# Altium schematic sheet FogCalBoard.SchDoc: Sample Sheet Title
size B; Date: MM/DD/YYYY; Author: Sample Author; Organization: ORGANIZATION; Address1: ADDRESS 1; Address2: ADDRESS 2; Address3: ADDRESS 3; Address4: ADDRESS 4; Revision: -; SheetNumber: 1; SheetTotal: 2; ENG_APP_DATE: --/--/--; DSN_APP_DATE: --/--/--; CHK_APP_DATE: --/--/--
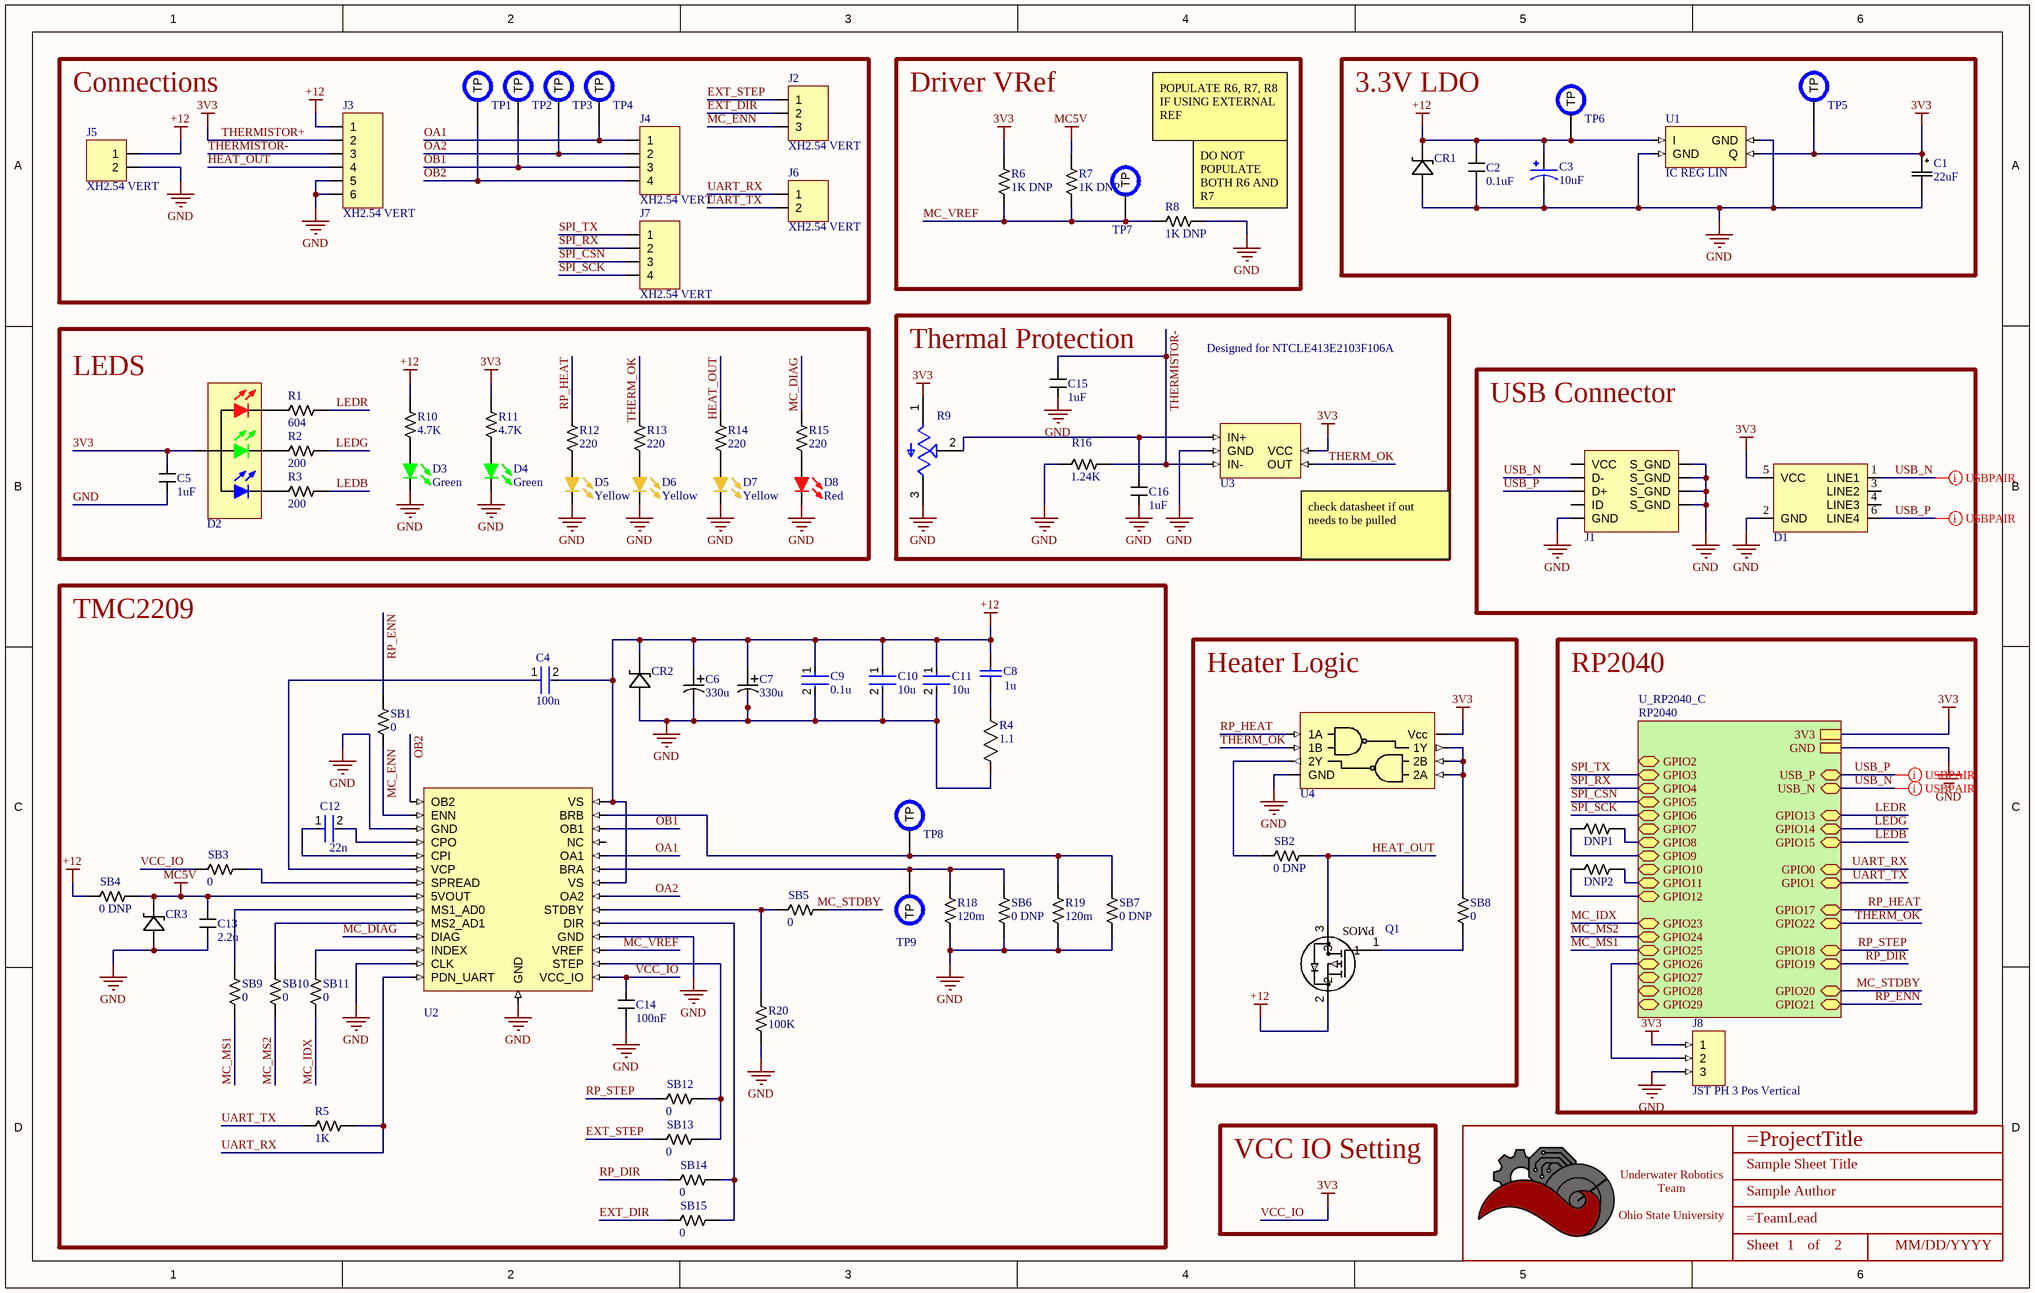
[diagram p0: FogCalBoard.SchDoc]

## Parts
*  Title_Block  [LOGO]  (value not drawn)  (graphical)
C1  value 22uF  [PCAP_8x5.4-ELECT_NCA]  (hidden comment: 22uF electrolytic 35 V)
C2  value 0.1uF  [CAPACITOR_0603]  (hidden comment: 100nF Ceramic 25V)
C3  value 10uF  [CAP_EEHZC1J100P]  (hidden comment: 10uF electrolytic 63V)
C4  100n  [FP-CC0603-DA-IPC_A]
C5  value 1uF  [CAPACITOR_0402]  (hidden comment: 1uF Ceramic 16V)
C6  value 330u  [CAP_EEE-FT1H331AP]  (hidden comment: EEE-FT1H331AP)
C7  value 330u  [CAP_EEE-FT1H331AP]  (hidden comment: EEE-FT1H331AP)
C8  1u  [CAPC1210(3225)220_N]
C9  0.1u  [FP-CC0603-DA-MFG]
C10  10u  [FP-2220-L_5_7_0_5-W_5_0_4-IPC_A]
C11  10u  [FP-2220-L_5_7_0_5-W_5_0_4-IPC_A]
C12  22n  [FP-C0805C-DN-MFG]
C13  value 2.2u  [CAPACITOR_0603]  (hidden comment: GRT188R61H225KE13D)
C14  Capacitance: 100nF  [CAPACITOR_0603]  (hidden comment: CC0603KRX7R9B1B10)
C15  value 1uF  [CAPACITOR_0603]  (hidden comment: 1uF Ceramic 16V)
C16  value 1uF  [CAPACITOR_0603]  (hidden comment: 1uF Ceramic 16V)
CR1  SMAJP4KE18A-TP  [DO-214AC]  (value not drawn)
CR2  SMAJP4KE18A-TP  [DO-214AC]  (value not drawn)
CR3  SMBJ5.0A  [DO-214AA]  (value not drawn)
D1  TVS DIODE 5VWM 25VC SOT23-6  [SOT 23-6L]  (value not drawn)
D2  EAST1616RGBB4  [LED_0606_4SMD]  (value not drawn)
D3  Color: Green  [LED_0603]  (hidden comment: IN-S63AT5G)
D4  Color: Green  [LED_0603]  (hidden comment: IN-S63AT5G)
D5  Color: Yellow  [LED_0603]  (hidden comment: 150060YS75000)
D6  Color: Yellow  [LED_0603]  (hidden comment: 150060YS75000)
D7  Color: Yellow  [LED_0603]  (hidden comment: 150060YS75000)
D8  Color: Red  [LED_0603]  (hidden comment: 150060RS75000)
DNP1  DNP  [RESISTOR_0402]  (value not drawn)
DNP2  DNP  [RESISTOR_0402]  (value not drawn)
J1  USB_MICRO R/A  [CONN_MINIUSB]  (value not drawn)
J2  XH2.54 VERT  [CONN_JST_XH254_3POS_VERT]
J3  XH2.54 VERT  [CONN_JST_XH254_6POS_VERT]
J4  XH2.54 VERT  [CONN_JST_XH254_4POS_VERT]
J5  XH2.54 VERT  [CONN_JST_XH254_2POS_VERT]
J6  XH2.54 VERT  [CONN_JST_XH254_2POS_VERT]
J7  XH2.54 VERT  [CONN_JST_XH254_4POS_VERT]
J8  JST PH 3 Pos Vertical  [CONN_JST_PH_3POS_VERT]
Q1  MOSFET P-CHANNEL 20V 4.7A SOT23  [SOT-23-3]  (value not drawn)
R1  Value  (Ohms): 604  [RESISTOR_0402]  (hidden comment: 604 Ohm 1% 1/16W)
R2  Value  (Ohms): 200  [RESISTOR_0402]  (hidden comment: 200 Ohm 1% 1/16W)
R3  Value  (Ohms): 200  [RESISTOR_0402]  (hidden comment: 200 Ohm 1% 1/16W)
R4  value 1.1  [RESISTOR_0603]  (hidden comment: CRCW06031R10FKEA)
R5  value 1K  [RESISTOR_0603]  (hidden comment: RMCF0603FT1K00)
R6  Value  (Ohms): 1K DNP  [RESISTOR_0603]  (hidden comment: 1k Ohm 5% 1/8W)
R7  Value  (Ohms): 1K DNP  [RESISTOR_0603]  (hidden comment: 1k Ohm 5% 1/8W)
R8  Value  (Ohms): 1K DNP  [RESISTOR_0603]  (hidden comment: 1k Ohm 5% 1/8W)
R9  TC33X-2-203E  [TRIM_TC33X-2-203E]  (value not drawn)
R10  Value  (Ohms): 4.7K  [RESISTOR_0603]  (hidden comment: 4.7k Ohm 5% 1/10W)
R11  Value  (Ohms): 4.7K  [RESISTOR_0603]  (hidden comment: 4.7k Ohm 5% 1/10W)
R12  Value  (Ohms): 220  [RESISTOR_0603]  (hidden comment: 220 Ohm 5% 1/8W)
R13  Value  (Ohms): 220  [RESISTOR_0603]  (hidden comment: 220 Ohm 5% 1/8W)
R14  Value  (Ohms): 220  [RESISTOR_0603]  (hidden comment: 220 Ohm 5% 1/8W)
R15  Value  (Ohms): 220  [RESISTOR_0603]  (hidden comment: 220 Ohm 5% 1/8W)
R16  Value (Ohms): 1.24K  [RESISTOR_0603]  (hidden comment: RES 1.24K OHM 1% 1/10W 0603)
R18  value 120m  [RESISTOR_1210]  (hidden comment: RCWE1210R120FKEA)
R19  value 120m  [RESISTOR_1210]  (hidden comment: RCWE1210R120FKEA)
R20  Value  (Ohms): 100K  [RESISTOR_0603]  (hidden comment: 100k Ohm 5% 1/8W)
SB1  Value  (Ohms): 0  [RESISTOR_0603]  (hidden comment: 0 Ohm Jumper No Fit)
SB2  Value  (Ohms): 0 DNP  [RESISTOR_0603]  (hidden comment: 0 Ohm Jumper No Fit)
SB3  Value  (Ohms): 0  [RESISTOR_0603]  (hidden comment: 0 Ohm Jumper No Fit)
SB4  Value  (Ohms): 0 DNP  [RESISTOR_0603]  (hidden comment: 0 Ohm Jumper No Fit)
SB5  Value  (Ohms): 0  [RESISTOR_0603]  (hidden comment: 0 Ohm Jumper No Fit)
SB6  Value  (Ohms): 0 DNP  [RESISTOR_0603]  (hidden comment: 0 Ohm Jumper No Fit)
SB7  Value  (Ohms): 0 DNP  [RESISTOR_0603]  (hidden comment: 0 Ohm Jumper No Fit)
SB8  Value  (Ohms): 0  [RESISTOR_0603]  (hidden comment: 0 Ohm Jumper No Fit)
SB9  Value  (Ohms): 0  [RESISTOR_0603]  (hidden comment: 0 Ohm Jumper No Fit)
SB10  Value  (Ohms): 0  [RESISTOR_0603]  (hidden comment: 0 Ohm Jumper No Fit)
SB11  Value  (Ohms): 0  [RESISTOR_0603]  (hidden comment: 0 Ohm Jumper No Fit)
SB12  Value  (Ohms): 0  [RESISTOR_0603]  (hidden comment: 0 Ohm Jumper No Fit)
SB13  Value  (Ohms): 0  [RESISTOR_0603]  (hidden comment: 0 Ohm Jumper No Fit)
SB14  Value  (Ohms): 0  [RESISTOR_0603]  (hidden comment: 0 Ohm Jumper No Fit)
SB15  Value  (Ohms): 0  [RESISTOR_0603]  (hidden comment: 0 Ohm Jumper No Fit)
TP1  PCB Test Point  [TESTPOINT_1.2MM]  (value not drawn)  (no BOM)
TP2  PCB Test Point  [TESTPOINT_1.2MM]  (value not drawn)  (no BOM)
TP3  PCB Test Point  [TESTPOINT_1.2MM]  (value not drawn)  (no BOM)
TP4  PCB Test Point  [TESTPOINT_1.2MM]  (value not drawn)  (no BOM)
TP5  PCB Test Point  [TESTPOINT_1.2MM]  (value not drawn)  (no BOM)
TP6  PCB Test Point  [TESTPOINT_1.2MM]  (value not drawn)  (no BOM)
TP7  PCB Test Point  [TESTPOINT_1.2MM]  (value not drawn)  (no BOM)
TP8  PCB Test Point  [TESTPOINT_1.2MM]  (value not drawn)  (no BOM)
TP9  PCB Test Point  [TESTPOINT_1.2MM]  (value not drawn)  (no BOM)
U1  IC REG LIN  [SOT-223-4]
U2  TMC2209-LA-T  [QFN-28]  (value not drawn)
U3  IC COMPARATOR 1 GEN PUR SC70-5  [SOT-353]  (value not drawn)
U4  IC GATE NAND SCHMITT 2CH 2IN SM8  [MSOP-8_PI4ULS5V202UEX]  (value not drawn)

## Blocks framed on the sheet
Connections: J2-J7 TP1-TP4
Driver VRef: R6-R8 TP7
3.3V LDO: C1-C3 CR1 TP5 TP6 U1
LEDS: C5 D2-D8 R1-R3 R10-R15
Thermal Protection: C15 C16 R9 R16 U3
USB Connector: D1 J1
TMC2209: C4 C6-C14 CR2 CR3 R4 R5 R18-R20 SB1 SB3-SB7 SB9-SB15 TP8 TP9 U2
Heater Logic: Q1 SB2 SB8 U4
RP2040: DNP1 DNP2 J8

## Sub-sheets
U_RP2040_C = RP2040: GPIO0 (bidir), GPIO1 (bidir), GPIO2 (bidir), GPIO3 (bidir), GPIO4 (bidir), GPIO5 (bidir), GPIO6 (bidir), GPIO7 (bidir), GPIO8 (bidir), GPIO9 (bidir), GPIO10 (bidir), GPIO11 (bidir), GPIO12 (bidir), GPIO13 (bidir), GPIO14 (bidir), GPIO15 (bidir), GPIO17 (bidir), GPIO18 (bidir), GPIO19 (bidir), GPIO20 (bidir), GPIO21 (bidir), GPIO22 (bidir), GPIO23 (bidir), GPIO24 (bidir), GPIO25 (bidir), GPIO26 (bidir), GPIO27 (bidir), GPIO28 (bidir), GPIO29 (bidir), 3V3, GND, USB_P (bidir), USB_N (bidir)

## Nets
3V3: C1.1 C5.1 C14.1 D1.5(VCC) D2.4 J3.2 J8.1 R6.1 R9.1(CCW) R11.1 SB3.2 TP5.TP U1.3(Q) U2.15(VCC_IO) U3.5(VCC) U4.8(Vcc) ; sheet U_RP2040_C/3V3  [also labelled THERMISTOR+, VCC_IO]
+12: C2.2 C3.1 C4.2 C6.1 C7.1 C8.2 C9.1 C10.1 C11.1 CR1.1(ANODE) CR2.1(ANODE) J3.1 J5.1 Q1.2 R10.1 SB4.2 TP6.TP U1.1(I) U2.22(VS) U2.28(VS)
GND: C1.2 C2.1 C3.2 C5.2 C6.2 C7.2 C9.2 C10.2 C11.2 C13.2 C14.2 C15.2 C16.2 CR1.2(CATHODE) CR2.2(CATHODE) CR3.2(ANODE) D1.2(GND) D3.2 D4.2 D5.2 D6.2 D7.2 D8.2 J1.5(GND) J1.6(S_GND) J1.7(S_GND) J1.8(S_GND) J1.9(S_GND) J3.5 J3.6 J5.2 J8.3 R4.1 R8.1 R9.3(CW) R16.2 R18.2 R19.2 R20.2 SB6.2 SB7.2 U1.2(GND) U1.4(GND) U2.3(GND) U2.13(CLK) U2.18(GND) U2.29(GND) U3.2(GND) U4.4(GND) ; sheet U_RP2040_C/GND
MC5V: C13.1 CR3.1(CATHODE) R7.1 SB4.1 U2.8(5VOUT)
EXT_DIR: J2.2 SB15.2
EXT_STEP: J2.1 SB13.2
HEAT_OUT: J3.4 Q1.3 R14.1 SB2.1
LEDB: R3.1 ; sheet U_RP2040_C/GPIO15
LEDG: R2.1 ; sheet U_RP2040_C/GPIO14
LEDR: R1.1 ; sheet U_RP2040_C/GPIO13
MC_DIAG: R15.1 U2.11(DIAG)
MC_ENN: J2.3 SB1.2 U2.2(ENN)
MC_IDX: SB11.2 ; sheet U_RP2040_C/GPIO23
MC_MS1: SB9.2 ; sheet U_RP2040_C/GPIO25
MC_MS2: SB10.2 ; sheet U_RP2040_C/GPIO24
MC_STDBY: SB5.1 ; sheet U_RP2040_C/GPIO20
MC_VREF: R6.2 R7.2 R8.2 TP7.TP U2.17(VREF)
OA1: J4.1 TP4.TP U2.24(OA1)
OA2: J4.2 TP3.TP U2.21(OA2)
OB1: J4.3 TP2.TP U2.26(OB1)
OB2: J4.4 TP1.TP U2.1(OB2)
RP_DIR: SB14.2 ; sheet U_RP2040_C/GPIO19
RP_ENN: SB1.1 ; sheet U_RP2040_C/GPIO21
RP_HEAT: R12.1 U4.1(1A) ; sheet U_RP2040_C/GPIO17
RP_STEP: SB12.2 ; sheet U_RP2040_C/GPIO18
SPI_CSN: J7.3 ; sheet U_RP2040_C/GPIO5
SPI_RX: J7.2 ; sheet U_RP2040_C/GPIO4
SPI_SCK: J7.4 ; sheet U_RP2040_C/GPIO6
SPI_TX: J7.1 ; sheet U_RP2040_C/GPIO3
THERM_OK: R13.1 U3.4(OUT) U4.2(1B) ; sheet U_RP2040_C/GPIO22
THERMISTOR-: C15.1 J3.3 R16.1 U3.3(IN-)
UART_RX: J6.1 R5.1 U2.14(PDN_UART) ; sheet U_RP2040_C/GPIO0
UART_TX: J6.2 R5.2 ; sheet U_RP2040_C/GPIO1
USB_N: D1.1(LINE1) J1.2(D-) ; sheet U_RP2040_C/USB_N
USB_P: D1.6(LINE4) J1.3(D+) ; sheet U_RP2040_C/USB_P
NetC4_1: C4.1 U2.6(VCP)
NetC8_1: C8.1 R4.2
NetC12_1: C12.1 U2.5(CPI)
NetC12_2: C12.2 U2.4(CPO)
NetC16_1: C16.1 R9.2(W) U3.1(IN+)
NetD2_1: D2.1 R1.2
NetD2_2: D2.2 R2.2
NetD2_3: D2.3 R3.2
NetD3_1: D3.1 R10.2
NetD4_1: D4.1 R11.2
NetD5_1: D5.1 R12.2
NetD6_1: D6.1 R13.2
NetD7_1: D7.1 R14.2
NetD8_1: D8.1 R15.2
NetDNP1_1: DNP1.1 ; sheet U_RP2040_C/GPIO8
NetDNP1_2: DNP1.2 ; sheet U_RP2040_C/GPIO9
NetDNP2_1: DNP2.1 ; sheet U_RP2040_C/GPIO11
NetDNP2_2: DNP2.2 ; sheet U_RP2040_C/GPIO12
NetJ8_2: J8.2 ; sheet U_RP2040_C/GPIO26
NetQ1_1: Q1.1 SB8.2
NetR18_1: R18.1 SB6.1 TP9.TP U2.23(BRA)
NetR19_1: R19.1 SB7.1 TP8.TP U2.27(BRB)
NetR20_1: R20.1 SB5.2 U2.20(STDBY)
NetSB2_2: SB2.2 U4.3(2Y)
NetSB3_1: SB3.1 U2.7(SPREAD)
NetSB8_1: SB8.1 U4.5(2A) U4.6(2B) U4.7(1Y)
NetSB9_1: SB9.1 U2.9(MS1_AD0)
NetSB10_1: SB10.1 U2.10(MS2_AD1)
NetSB11_1: SB11.1 U2.12(INDEX)
NetSB12_1: SB12.1 SB13.1 U2.16(STEP)
NetSB14_1: SB14.1 SB15.1 U2.19(DIR)

Not connected (* = marked no-connect by the designer): D1 3(LINE2) 4(LINE3); J1 1(VCC) 4(ID); U2 25(NC)

## Layout directives
differential pair: USB_N, USB_P

## Notes on the sheet
- POPULATE R6, R7, R8 IF USING EXTERNAL REF
- (near R8) DO NOT POPULATE BOTH R6 AND R7
- Designed for NTCLE413E2103F106A
- (near U3) check datasheet if out needs to be pulled
- VCC IO Setting
- DWG. NO.
- REV.
- SHT.
- THIS DOCUMENT AND THE DATA DISCLOSED HEREIN OR HEREWITH IS THE PROPERTY OF ALTIUM LIMITED AND MAY BE FREELY DISTRIBUTED IN WHOLE. NO RIGHTS ARE RESERVED OR EXPRESS OR IMPLIED WARANTEE GIVEN.
- REVISION
- DESCRIPTION
- DATE
- APPROVED
- ENG:
- APPROVALS
- PROJECT
- DSN:
- CHK:
- REFERENCE DOCUMENTS
- PROJECT REVISION:
- TITLE
- DOCUMENT REVISION:
- DESIGN ITEM:
- BOM:
- FAB DWG:
- PCB DWG:
- ASSY DWG:
- SCALE:
- SIZE
- B
- CAGE CODE
- FILE NAME
- DWG NO.
- SHEET
- OF
- REV
- (in symbol Title_Block) Underwater Robotics Team / Ohio State University; Sheet; of
- (in symbol TSM500P02CX) PMOS

## Library data of the parts
* = Title_Block: UWRT Schematic Title Block Template / Created June 2021, Dylan Trainor
C1 = CAP ALUM 22UF 20% 35V SMD: 22 µF 35 V Aluminum Electrolytic Capacitors Radial, Can - SMD 1000 Hrs; Made by: Robert Pafford; Voltage: 35V; Supplier 1: Digi-Key; Supplier Part Number 1: PCE3952DKR-ND
C2 = CAPACITOR_0.1uF_0603_25V: Cap 100nF 25V +/-10% / Ceramic 0603; Voltage: 6.3V; Made By: Flip B; ComponentLink1Description: Datsheet; ComponentLink1URL: https://www.mouser.com/datasheet/2/212/KEM_C1002_X7R_SMD-1102033.pdf; Tolerance: +/- 10%; Supplier 1: Digikey; Supplier Part Number 1: 1276-1006-1-ND
C3 = CAP ALUM 10UF 20% 63V SMD: 10 µF 63 V Aluminum - Polymer Capacitors Radial, Can SMD 120mOhm; Made by: Robert Pafford; Tolerance: +/- 20%; Max Voltage: 63V; Supplier 1: Digi-Key; Supplier Part Number 1: P15466CT-ND
C4 = CMP-03422-001523-1: CAP CER 3900PF 50V X7R 0603; Capacitance: 3.9nF; Tolerance: 5%; Width: 0.8mm; Case Code (Imperial): 0603; Case Code (Metric): 1608; Max Operating Temperature: 125°C; Radiation Hardening: No; Voltage Rating: 50V; Case/Package: 0603; Height: 0.8mm; Resistor Type: Ceramic; Length: 1.6mm; Depth: 0.8mm; Construction: Flat; Packaging: Tape and Reel; Min Operating Temperature: -55°C; Dielectric: X7R; Lead Free: Lead Free; Voltage Rating (DC): 50V; RoHS Compliant: Yes; Thickness: 0.035inch; Halogen Free: Halogen Free; Termination: SMD/SMT; Mount: Surface Mount; Series: CC
C5 = CAPACITOR_1uF_0402: Cap 1uF 16V +/-10% / Ceramic 0402; Made By: Robert Pafford; Tolerance: +/- 10%; Voltage: 16V; Supplier 1: Digi-Key; Supplier Part Number 1: 478-0402YD105KAT4ADKR-ND
C6 C7 = CAP ALUM 330UF 20% 50V SMD: 330 µF 50 V Aluminum Electrolytic Capacitors Radial, Can - SMD 120mOhm @ 100kHz 2000 Hrs @ 105°C; Mfr_Name: Panasonic
C8 = CMP-1038-02030-1: CAP 1uF 50V ±10% 1210 (3225 Metric) Thickness 2.2mm SMD; Case-EIA: 1210; Tolerance: Â±10%; Case-Metric: 3225; Value: 1uF; Rated Voltage: 50 V; Max Thickness: 2.2 mm; Technology: SMT
C9 = CMP-2100-03601-2: CAP CER 0.1UF 50V X7R 0603; Manufacturer: YAGEO; Manufacturer Part Number: CC0603KRX7R9BB104; Material: Ceramic; Capacitance: 100 nF; Temperature Coefficient: 15%; Tolerance: 0.1; Value: 100 nF; Height: 0.9mm; Voltage: 50 V; ComponentLink2Description: Datasheet; Device Class L2: Capacitors; Temperature Range High: +125°C; Category: Cap; Footprint Url: http://www.yageo.com/exep/pages/download/literatures/UPY-C_GEN_24.pdf; ComponentLink2URL: http://www.yageo.com/documents/recent/UPY-GPHC_X7R_6.3V-to-50V_18.pdf; Package: CC0603-DA; Temperature: -55°C to +125°C; Voltage Rating: 50 V; Temperature Characteristic: X7R; Device Class L1: Passive Components; Temperature Range Low: -55°C; RoHS: TRUE; Automotive: No; Device Class L3: Ceramic Capacitors; Octopart: https://octopart.com/cc0603krx7r9bb104-yageo-42244635; Mouser Description: Multilayer Ceramic Capacitor, CC Series, 0.1 - F, - 10%, X7R, 50 V, 0603 [1608 Metric]; Lead Free: Yes; Digikey Description: CAP CER 0.1UF 50V X7R 0603
C10 C11 = CMP-04427-001477-1: General Purpose Ceramic Capacitor, 2220, 10uF, 10%, X7R, 15%, 50V; Dissipation Factor: 2.5%; Tolerance: 10%; Depth: 5mm; Thickness: 0.11inch; Construction: Flat; REACH SVHC: No SVHC; Length: 5.7mm; Voltage Rating (DC): 50V; Contact Plating: Tin; Capacitance: 10uF; Radiation Hardening: No; Packaging: Tape and Reel; Height: 2.79mm; Width: 0.197inch; Dielectric: X7R; Case Code (Imperial): 2220; Package Quantity: 500; Max Operating Temperature: 125°C; Case/Package: 2220; Voltage: 50V; Voltage Rating: 50V; Number of Pins: 2; Case Code (Metric): 5750; Lead Free: Lead Free; Series: Standard; Termination: SMD/SMT; RoHS Compliant: Yes; Mount: Surface Mount; Min Operating Temperature: -55°C
C12 = CMP-2007-03642-2: CAP CER 0.022UF 50V C0G/NP0 0805; Manufacturer Part Number: C0805C223J5GACTU; Manufacturer: KEMET; Temperature Characteristic: C0G; Value: 22,000 pF; Temperature Coefficient: 30ppm/°C; Material: Ceramic; Tolerance: 0.05; Voltage Rating: 50 V; Package: C0805C-DN; Octopart: https://octopart.com/c0805c223j5gactu-kemet-9145108; Ipc Land Pattern Name: CAPC200125X78; Height: 0.88mm; Mouser Description: Multilayer Ceramic Capacitors MLCC - SMD/SMT 50volts 0.022uF 5% C0G; Temperature Range Low: -55°C; Lead Free: Yes; Device Class L2: Capacitors; ComponentLink2URL: https://content.kemet.com/datasheets/KEM_C1003_C0G_SMD.pdf; ComponentLink2Description: Datasheet; Category: Cap; Device Class L1: Passive Components; Digikey Description: CAP CER 0.022UF 50V C0G/NP0 0805; Capacitance: 22,000 pF; RoHS: TRUE; Device Class L3: Ceramic Capacitors; Temperature Range High: +125°C; Temperature: -55°C to +125°C; Automotive: No
C13 = CAP CER 2.2UF 50V X5R 0603: 2.2 µF ±10% 50V Ceramic Capacitor X5R 0603 (1608 Metric)
C14 = CAP CER 100n 50V 0603: Ceramic Capacitor, Multilayer, Ceramic, 50V, 10% +Tol, 10% -Tol, X7R, 15% TC, 0.1uF, Surface Mount, 0603; Manufacturer: Yageo; Manufacturer Part Number: CC0603KRX7R9BB104; Multilayer: Yes; Supplier 1: Future Electronics; Supplier Part Number 1: 9017302; RoHS: Yes; Category: Ceramic Capacitors; Stock 1: 16646; Pricing 1: 1=0.1, 15=0.0691, 100=0.0475, 400=0.0317, 2000=0.0133 (USD); Mount: Surface Mount; Number of Pins: 2; Dielectric Material: Ceramic; Package Shape: Rectangular; Size Code: 0603; Terminal Finish: Nickel; Min Operating Temperature: -55°C; Max Operating Temperature: 125°C; JESD-609 Code: e3; Capacitor Type: Ceramic; Negative Tolerance: 10%; Package Style: SMTMeter; Packaging: Tape and Reel; Positive Tolerance: 10%; Rated DC Voltage (URdc): 50V; Temperature Characteristics Code: X7R; Termination: Wraparound; Length: 1.6mm; Width: 0.8mm; Height: 0.8mm; Reach SVHC Compliant: Yes; RoHS Compliant: Yes; ComponentLink1URL: https://datasheet.ciiva.com:443/pdfs/VipMasterIC/IC/YAGO/YAGO-S-A0003557223/YAGO-S-A0003557223-1.pdf?src-supplier=IHS+Markit; ComponentLink1Description: https://datasheet.ciiva.com:443/pdfs/VipMasterIC/IC/YAGO/YAGO-S-A0003557223/YAGO-S-A0003557223-1.pdf?src-supplier=IHS+Markit; ComponentLink2URL: https://datasheet.ciiva.com/11786/0900766b80d84f1d-11786061.pdf?src-supplier=Rs; ComponentLink2Description: https://datasheet.ciiva.com/11786/0900766b80d84f1d-11786061.pdf?src-supplier=Rs; ComponentLink3URL: https://datasheet.ciiva.com/7978/1489800-7978166.pdf?src-supplier=Element14; ComponentLink3Description: https://datasheet.ciiva.com/7978/1489800-7978166.pdf?src-supplier=Element14; ComponentLink4URL: https://datasheet.ciiva.com/22749/1489800-22749214.pdf?src-supplier=Element14; ComponentLink4Description: https://datasheet.ciiva.com/22749/1489800-22749214.pdf?src-supplier=Element14; ComponentLink5URL: https://datasheet.ciiva.com/31394/1489800-31394927.pdf?src-supplier=Farnell; ComponentLink5Description: https://datasheet.ciiva.com/31394/1489800-31394927.pdf?src-supplier=Farnell; ComponentLink6URL: https://datasheet.ciiva.com/144/mlccorderingcode-144176.pdf?src-supplier=Digikey; ComponentLink6Description: https://datasheet.ciiva.com/144/mlccorderingcode-144176.pdf?src-supplier=Digikey; ComponentLink7URL: https://datasheet.ciiva.com/144/mlccorderingcode-144177.pdf?src-supplier=Digikey; ComponentLink7Description: https://datasheet.ciiva.com/144/mlccorderingcode-144177.pdf?src-supplier=Digikey; ComponentLink8URL: https://datasheet.ciiva.com/144/mlccorderingcode-144178.pdf?src-supplier=Digikey; ComponentLink8Description: https://datasheet.ciiva.com/144/mlccorderingcode-144178.pdf?src-supplier=Digikey; ComponentLink9URL: https://datasheet.ciiva.com/8033/70765-8033819.pdf?src-supplier=Element14; ComponentLink9Description: https://datasheet.ciiva.com/8033/70765-8033819.pdf?src-supplier=Element14; ComponentLink10URL: https://datasheet.ciiva.com/8033/70765-8033821.pdf?src-supplier=Element14; ComponentLink10Description: https://datasheet.ciiva.com/8033/70765-8033821.pdf?src-supplier=Element14
C15 C16 = CAPACITOR_1uF_0603: Cap 1uF 16V +/-10% / Ceramic 0603; Made By: Flip B; Tolerance: +/- 10%; Voltage: 16V; Supplier 1: Arrow Electronics; Supplier Part Number 1: C1608X7R1C105K080AC
CR1 CR2 = TVS_Diode_25.5V_16.1A: TVS DIODE 15.3VWM 25.5VC DO214AC; Mfr_Name: MCC; Type: DEV; Copyright: Copyright (C) 2023 Ultra Librarian. All rights reserved.; Manufacturer_Part_Number: SMAJP4KE18A-TP; RefDes: RefDes; Supplier 1: Arrow Electronics; Supplier Part Number 1: SMAJP4KE18A-TP
CR3 = TVS DIODE 5VWM 9.2VC SMB: 9.2V Clamp 65.22A Ipp Tvs Diode Surface Mount SMB; Mfr_Name: Littelfuse Inc
D1 = RCLAMP0504S.TCT: 25V Clamp 6A (8/20µs) Ipp Tvs Diode Surface Mount SOT-23-6; Made By: Robert Pafford; Reverse Standoff Voltage (Typ): 5V; Breakdown Voltage (Min): 6V; Supplier 1: Digi-Key; Supplier Part Number 1: RCLAMP0504SCT-ND; Clamping Voltage (Max): 25V
D2 = LED_RGB_4SMD: LED RGB CLEAR 4SMD; Made By: Robert Pafford; Red Forward Voltage: 1.8V; Red Forward Current: 5mA; Green Forward Voltage: 2.8V; ComponentLink1Description: Datasheet; ComponentLink1URL: https://everlightamericas.com/index.php?controller=attachment&id_attachment=3220; Package: 4-SMD; Green Forward Current: 5mA; Blue Forward Voltage: 2.8V; Blue Forward Current: 5mA; Color: RGB; Supplier 1: Digi-Key; Supplier Part Number 1: 1080-1552-1-ND
D3 D4 = LED_Green_0603_3V: LED Green Vf= 3V If = 0.005A / IN-S63AT5G; Made By: Robert Pafford; Forward Current: 5mA; ComponentLink1Description: Datasheet; ComponentLink1URL: https://www.we-online.de/katalog/datasheet/150060GS75000.pdf; Forward Voltage: 3V; Package: 0603; Supplier 1: Digi-Key; Supplier Part Number 1: 1830-1062-1-ND
D5-D7 = LED_Yellow_0603: LED Yellow Vf= 2V If = 0.020A / 150060YS75000; Made By: Robert Pafford; Forward Current: 20mA; Forward Voltage: 2V; Package: 0603; Supplier 1: Digi-Key; Supplier Part Number 1: 732-4981-1-ND
D8 = LED_Red_0603: LED Red Vf= 2V If = 0.020A / 150060RS75000; Made By: Robert Pafford; Forward Current: 20mA; Forward Voltage: 2V; Package: 0603; Supplier 1: Digi-Key; Supplier Part Number 1: 732-4978-1-ND
DNP1 DNP2 = DNP_0402: Do Not Populate 0402
J1 = CONN_MICROUSB: Amphenol Micro USB-B / USB2.0 5 Pin Right Angle SMD; Pitch: 0.65mm; Current Per Pin: 1.8A; Number of Positions: 5; Manufacturer: Amphenol; Configuration: Right Angle; Color: Silver; Created By: Flip B; ComponentLink1Description: Datasheet; ComponentLink1URL: https://cdn.amphenol-icc.com/media/wysiwyg/files/documentation/datasheet/inputoutput/io_usb_micro.pdf?__cf_chl_jschl_tk__=05693735e19256298f6ef6ca2bb2e65c376a4f56-1625503833-0-Abitsb0-ufjOXJYs_S3J3r2iTn-nObalbmXUksF1VvO_h_WEmRdMlUD1I8-hmWSEVWzY1pirKnrPZWfgY3851qyBZe5ZvnNQePLGIzUgdEIQBVUyW36RsbYpDLEWxJ4horD-5gChFgobLYqwmG5aHl0E8lIn_twwPPrOxilK2gP0q9t_CNOs_u5fMqXvXUrlsOv8tIE2NRlu6NVP8qtkL2GjhlkeTUbDMF8WvvpPDTFOgvZ4Y16Ej8F8AhWos88mo5B1HssXozw0XrkJQIqERITUu6rqloz9kf4ZzhBHtDAt-IkiAFY_Ds9SW8FYKKTtINJVpHZQ6Gyu1FFM4Dc9MO0maE8_mmNcwlxqyRoRk_MPWW8VyByXWM5RSp52jteRKw7FeI9WIYvCbPAOy0Eyib-aseIQsnGbglBcUY6_2xp8GYaJM38H3dNvBPsSOfJBPndKedwKHllxjkucXn6xsN0sDXkpGN-cu8_2bDTJ0g-uUucKSCooYX-ApSDNGpkA_p9zv1SOAD8c0zaZVmtiBsN75QpVz2rzq9_BFxOywPvR; Series: 10118192; Supplier 1: Digi-Key; Supplier Part Number 1: 609-4613-1-ND
J2 = CONN_JST_XH254_3POS_VERT: JST XH 2.54mm Pitch 3 Pos Vertical; Current Per Pin: 4A; Number of Positions: 3; NOTE: Do not use JST 2.5mm parts with this footprint. JST does not make 2.54mm pitch pins, rather only clones make this connector!; Manufacturer: JST; Pitch: 2.54mm; Configuration: Vertical; Color: White; Created By: Robert P; Series: XH 2.54; ComponentLink1Description: Purchase Link; ComponentLink1URL: https://www.amazon.com/460PCS-XH2-54-Connector-Terminal-Connectors/dp/B09DBGVX5C
J3 = CONN_JST_XH254_6POS_VERT: JST XH 2.54mm Pitch 6 Pos Vertical; Current Per Pin: 4A; Number of Positions: 6; NOTE: Do not use JST 2.5mm parts with this footprint. JST does not make 2.54mm pitch pins, rather only clones make this connector!; Manufacturer: JST; Pitch: 2.54mm; Configuration: Vertical; Color: White; Created By: Flip B; Series: XH 2.54; Supplier 1: Digi-Key; Supplier Part Number 1: 455-2264-1-ND
J4 J7 = CONN_JST_XH254_4POS_VERT: JST XH 2.54mm Pitch 4 Pos Vertical; Current Per Pin: 4A; Number of Positions: 4; NOTE: Do not use JST 2.5mm parts with this footprint. JST does not make 2.54mm pitch pins, rather only clones make this connector!; Manufacturer: JST; Pitch: 2.54mm; Configuration: Vertical; Color: White; Created By: Robert P; Series: XH 2.54; ComponentLink1Description: Purchase Link; ComponentLink1URL: https://www.amazon.com/460PCS-XH2-54-Connector-Terminal-Connectors/dp/B09DBGVX5C
J5 J6 = CONN_JST_XH254_2POS_VERT: JST XH 2.54mm Pitch 2 Pos Vertical; Current Per Pin: 4A; Number of Positions: 2; NOTE: Do not use JST 2.5mm parts with this footprint. JST does not make 2.54mm pitch pins, rather only clones make this connector!; Manufacturer: JST; Pitch: 2.54mm; Configuration: Vertical; Color: White; Created By: Robert P; Series: XH 2.54; ComponentLink1Description: Purchase Link; ComponentLink1URL: https://www.amazon.com/460PCS-XH2-54-Connector-Terminal-Connectors/dp/B09DBGVX5C
J8 = CONN_JST_PH_3POS_VERT
Q1 = TSM500P02CX: P-Channel 20 V 4.7A (Tc) 1.56W (Tc) Surface Mount SOT-23; Vendor: Taiwan Semiconductor Corporation; Vgs (Max): ±10V; Vgs (th): 800mV @ 250µA; Rds (on): 50mOhm @ 3A, 4.5V; Amp Rating: 4.7 A; FET Type: P-Channel; Package: TO-236-3, SC-59, SOT-23-3; Manufacturer_Part_Number: TSM500P02CX; Vdss: 20 V; Power Dissipation: 1.56W (Tc); Created By: Robert Pafford; Supplier 1: Digi-Key; Supplier Part Number 1: TSM500P02CXRFGCT-ND
R1 = RESISTOR_604_0402: RES 604 OHM 1% 1/16W 0402; Tolerance: +/- 1%; Made By: Robert Pafford; Wattage: 1/16W; Supplier: Digikey; Digikey Part Numer: CR0603-JW-104ELFTR-ND; Supplier 1: Digi-Key; Supplier Part Number 1: 13-AC0402FR-07604RLCT-ND
R2 R3 = RESISTOR_200_0402: RES 200 OHM 1% 1/16W 0402; Tolerance: +/- 1%; Made By: Robert Pafford; Wattage: 1/16W; Supplier: Digikey; Digikey Part Numer: CR0603-JW-104ELFTR-ND; Supplier 1: Digi-Key; Supplier Part Number 1: YAG3453CT-ND
R4 = RES SMD 1.1 OHM 1% 1/10W 0603: 1.1 Ohms ±1% 0.1W, 1/10W Chip Resistor 0603 (1608 Metric) Automotive AEC-Q200 Thick Film; Mfr_Name: Vishay
R5 = RES 1K OHM 1% 1/10W 0603: 1 kOhms ±1% 0.1W, 1/10W Chip Resistor 0603 (1608 Metric) Automotive AEC-Q200 Thick Film
R6-R8 = RESISTOR_1K_0603: RES 1k OHM 5% 1/8W 0603; Tolerance: +/- 5%; Made By: Robert Pafford; ComponentLink1Description: Datasheet; ComponentLink1URL: https://www.bourns.com/docs/product-datasheets/CRxxxxx.pdf; Wattage: 1/8W; Supplier: Digikey; Digikey Part Numer: CR0603-JW-104ELFTR-ND; Supplier 1: Digi-Key; Supplier Part Number 1: 2019-RK73B1JTTD102JCT-ND
R9 = TC33X-2-203E: 20 kOhms 0.1W, 1/10W J Lead Surface Mount Trimmer Potentiometer Cermet 1 Turn Top Adjustment; MF: Bourns; Value: *; SnapEDA_Link: https://www.snapeda.com/parts/TC33X-2-203E/Bourns/view-part/312812/?ref=snap; Check_prices: https://www.snapeda.com/parts/TC33X-2-203E/Bourns/view-part/312812/?ref=eda; Digi-Key_Part_Number: TC33X-2-203ECT-ND; Purchase-URL: https://pricing.snapeda.com/search/part/TC33X-2-203E/?ref=eda; Package: 1608 Bourns; MP: TC33X-2-203E; Supplier 1: Mouser; Supplier Part Number 1: 652-TC33X-2-203E
R10 R11 = RESISTOR_4.7K_0603: RES 4.7k OHM 5% 1/10W 0603; Tolerance: +/- 5%; Made By: Robert Pafford; Wattage: 1/10W; Supplier: Digikey; Digikey Part Numer: CR0603-JW-104ELFTR-ND; Supplier 1: Digi-Key; Supplier Part Number 1: RMCF0603JT4K70CT-ND
R12-R15 = RESISTOR_200_0603: RES 220 OHM 5% 1/8W 0603; Tolerance: +/- 5%; Made By: John S; ComponentLink1Description: Digikey; ComponentLink1URL: https://www.digikey.com/en/products/detail/koa-speer-electronics-inc/RK73B1JTTD101J/9844701; Wattage: 1/8W; Supplier 1: Digi-Key; Supplier Part Number 1: 2019-RK73B1JTTD221JCT-ND
R16 = RESISTOR_1.24K_1%_0603: 1.24 kOhms ±1% 0.1W, 1/10W Chip Resistor 0603 (1608 Metric) Automotive AEC-Q200 Thick Film; Tolerance: +/- 1%; Wattage: 1/10W; Created By: John Ulm; Verified By: *; Supplier 1: Digi-Key; Supplier Part Number 1: RMCF0603FT1K24CT-ND
R18 R19 = RES 0.12 OHM 1% 1W 1210: 120 mOhms ±1% 1W Chip Resistor 1210 (3225 Metric) Automotive AEC-Q200, Current Sense, Moisture Resistant Thick Film
R20 = RESISTOR_100K_0603: RES 100k OHM 5% 1/10W 0603; Tolerance: +/- 5%; Made By: Flip B; ComponentLink1Description: Datasheet; ComponentLink1URL: https://www.bourns.com/docs/product-datasheets/CRxxxxx.pdf; Wattage: 1/10W; Supplier: Digikey; Digikey Part Numer: CR0603-JW-104ELFTR-ND; Supplier 1: Digi-Key; Supplier Part Number 1: CR0603-JW-104ELFCT-ND
SB1-SB15 = JUMPER_0_0603: 0 Ohm Jumper No Fit for Solder Bridge; Made By: Robert Pafford; ComponentLink1Description: Digikey; ComponentLink1URL: https://www.digikey.com/en/products/detail/koa-speer-electronics-inc/RK73B1JTTD101J/9844701
TP1-TP9 = TESTPOINT: Made By: Robert Pafford
U1 = TLE42744GSV33HTMA1: Linear Voltage Regulator IC Positive Fixed 1 Output 400mA PG-SOT223-4
U2 = TMC2209-LA-T: Bipolar Motor Driver Power MOSFET Step/Direction, UART 28-QFN (5x5)
U3 = LMV331IDCKR: Comparator General Purpose Open-Collector SC-70-5
U4 = SN74LVC2G132DCTR: NAND Gate IC 2 Channel Schmitt Trigger SM8